# Altium schematic sheet Pressure.SchDoc: Pressure Sensor
size A4; DocumentNumber: 7; Revision: 0v1; SheetNumber: 7; SheetTotal: 9
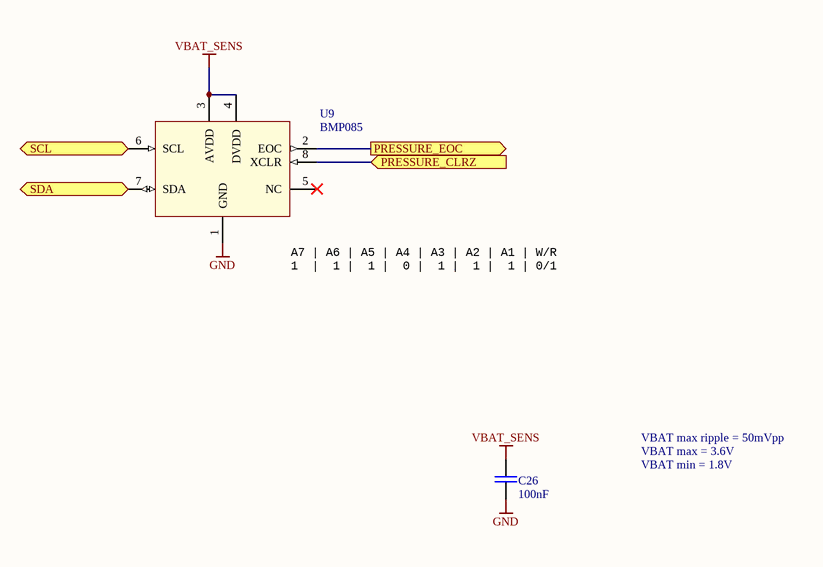
[diagram p0: Pressure.SchDoc]

## Parts
C26  100nF  [0603]
U9  BMP085  [CLCC-8]

## Ports
PRESSURE_CLRZ (in), PRESSURE_EOC (out), SCL (in), SDA (bidir)

## Nets
GND: C26.1 U9.1(GND)
VBAT_SENS: C26.2 U9.3(AVDD) U9.4(DVDD)
PRESSURE_CLRZ: U9.8(XCLR) ; port PRESSURE_CLRZ
PRESSURE_EOC: U9.2(EOC) ; port PRESSURE_EOC
SCL: U9.6(SCL) ; port SCL
SDA: U9.7(SDA) ; port SDA

Not connected (* = marked no-connect by the designer): U9 5(NC)*

## Notes on the sheet
- (near U9) A7 | A6 | A5 | A4 | A3 | A2 | A1 | W/R
  1  |  1 |  1 |  0 |  1 |  1 |  1 | 0/1
- VBAT min = 1.8V
- VBAT max = 3.6V
- VBAT max ripple = 50mVpp
- Title
- Size:
- Date:
- A4
- Number:
- Time:
- Revision:
- Sheet
- of
- File:

## Library data of the parts
C26 = CAP: Capacitor; Owner: Nuno Brum; Sub-Type: Ceramic; Assembly: INS; Maximum Voltage: *; Creation Date: 2005-04-28; Status: Valid; Validation date: 2006-05-15; Type: Capacitor
U9 = BMP085: Digital Pressure Sensor; Type: IC; Creation Date: 2012-03-05